# EAGLE schematic ME433 (EAGLE 7.3.0)
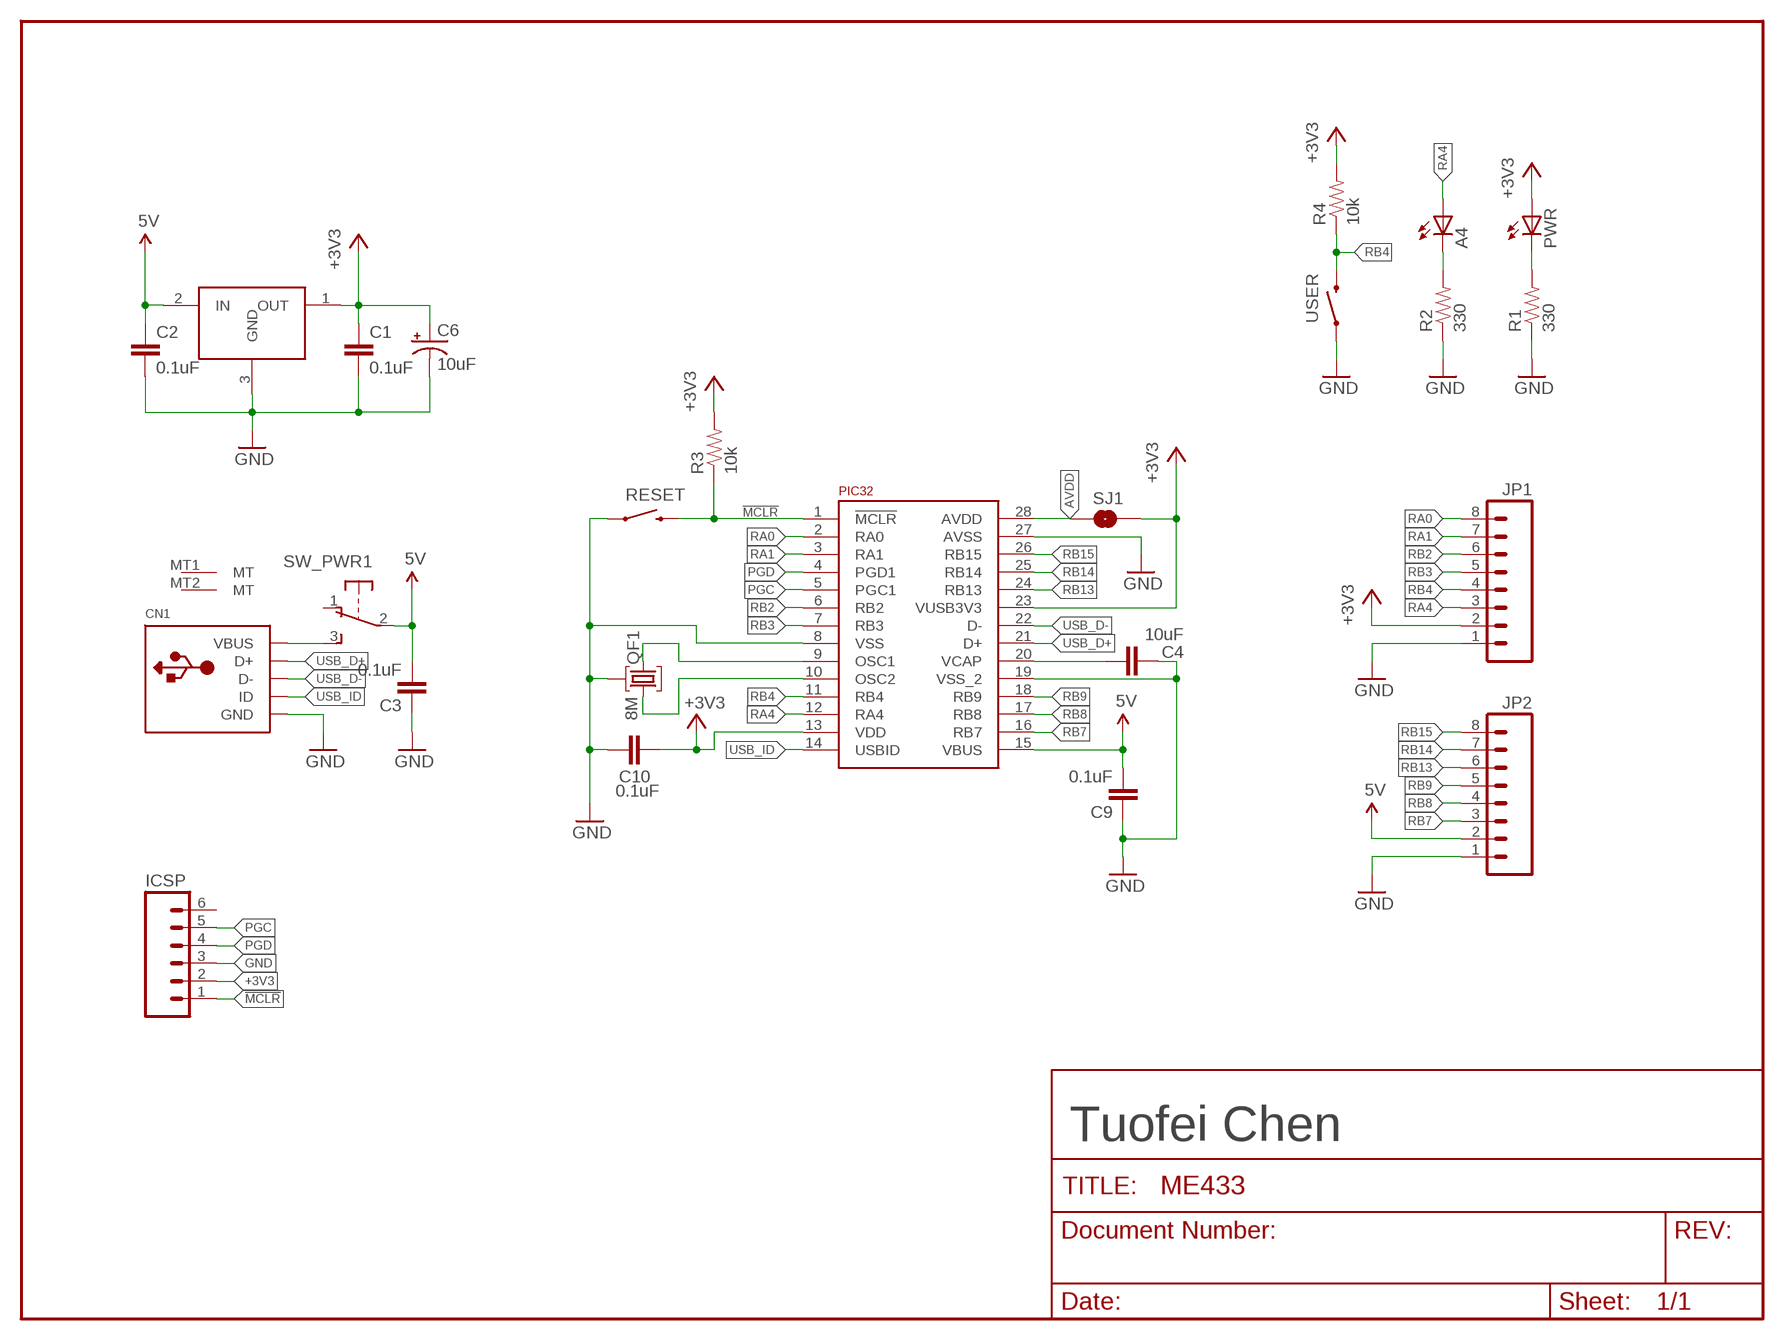
[diagram p0: schematic, sheet 1]

## Parts
3V3-REG  3V3-REG-TO92  [TO-92]
A4  LED3MM  [LED3MM]
C1  0.1uF  CAPPTH  [CAP-PTH-SMALL]
C2  0.1uF  CAPPTH  [CAP-PTH-SMALL]
C3  0.1uF  CAPPTH  [CAP-PTH-SMALL]
C4  10uF  CAPPTH  [CAP-PTH-SMALL]
C6  10uF  CAP_POLPTH1  [CPOL-RADIAL-100UF-25V]
C9  0.1uF  CAPPTH  [CAP-PTH-SMALL]
C10  0.1uF  CAPPTH  [CAP-PTH-SMALL]
CN1  USBMOLEX  [USB-MINIB-THM-MOLEX]
ICSP  M06LONGPADS  [1X06_LONGPADS]
JP1  M08  [1X08]
JP2  M08  [1X08]
PIC32  PIC32MX250F128B-DIP  [DIP28]
PWR  LED3MM  [LED3MM]
QF1  8M  8M10AHC49T  [HC49U]
R1  330  RESISTORAXIAL-0.3  [AXIAL-0.3]
R2  330  RESISTORAXIAL-0.3  [AXIAL-0.3]
R3  10k  RESISTORAXIAL-0.3  [AXIAL-0.3]
R4  10k  RESISTORAXIAL-0.3  [AXIAL-0.3]
RESET  PUSH_BUT  [1X02_LOCK_LONGPADS]
SJ1  SOLDERJUMPERNC  [SJ_2S]
SW_PWR  EG1213  [EG1213]
USER  PUSH_BUT  [1X02_LOCK_LONGPADS]

## Nets
5V: 3V3-REG.2(IN) C2.1 C3.2 C9.2 JP2.2 PIC32.15(VBUS) SW_PWR.2(1:P)
!MCLR: ICSP.1 PIC32.1(!MCLR) R3.P$1 RESET.2
+3V3: 3V3-REG.1(OUT) C1.1 C6.1(+) C10.2 ICSP.2 JP1.2 PIC32.13(VDD) PIC32.23(VUSB3V3) PWR.A R3.P$2 R4.P$2 SJ1.1
AVDD: PIC32.28(AVDD) SJ1.2
GND: 3V3-REG.3(GND) C1.2 C2.2 C3.1 C4.2 C6.2(-) C9.1 C10.1 CN1.GND ICSP.3 JP1.1 JP2.1 PIC32.8(VSS) PIC32.19(VSS_2) PIC32.27(AVSS) QF1.2 R1.P$1 R2.P$1 RESET.1 USER.1
N$1: PIC32.9(OSC1) QF1.1
N$2: PIC32.10(OSC2) QF1.3
N$3: A4.K(C) R2.P$2
N$8: C4.1 PIC32.20(VCAP)
N$12: PWR.K(C) R1.P$2
N$13: CN1.VBUS SW_PWR.3(1:S)
PGC: ICSP.5 PIC32.5(PGC1)
PGD: ICSP.4 PIC32.4(PGD1)
RA0: JP1.8 PIC32.2(RA0)
RA1: JP1.7 PIC32.3(RA1)
RA4: A4.A JP1.3 PIC32.12(RA4)
RB2: JP1.6 PIC32.6(RB2)
RB3: JP1.5 PIC32.7(RB3)
RB4: JP1.4 PIC32.11(RB4) R4.P$1 USER.2
RB7: JP2.3 PIC32.16(RB7)
RB8: JP2.4 PIC32.17(RB8)
RB9: JP2.5 PIC32.18(RB9)
RB13: JP2.6 PIC32.24(RB13)
RB14: JP2.7 PIC32.25(RB14)
RB15: JP2.8 PIC32.26(RB15)
USB_D+: CN1.D+ PIC32.21(D+)
USB_D-: CN1.D- PIC32.22(D-)
USB_ID: CN1.ID PIC32.14(USBID)
Unconnected: ICSP.6 SW_PWR.1(1:O) SW_PWR.MT1(MT) SW_PWR.MT2(MT)

## Notes on the sheet
- Tuofei Chen

## Library data of the parts
3V3-REG = Francis-Project:3V3-REG-TO92
A4 PWR = SparkFun:LED: LEDs Standard schematic elements and footprints for 5mm, 3mm, 1206, and 0603 sized LEDs. 5mm - Spark Fun Electronics SKU : COM-00529 (and others)
C1-C4 C9 C10 = SparkFun-Capacitors:CAP: Capacitor Standard 0603 ceramic capacitor, and 0.1" leaded capacitor.
C6 = SparkFun:CAP_POL: Capacitor Polarized These are standard SMD and PTH capacitors. Normally 10uF, 47uF, and 100uF in electrolytic and tantalum varieties. Always verify the external diameter of the through hole cap, it varies with capacity, voltage, and manufacturer. The EIA devices should be standard.
CN1 = adafruit:USB: USB Connectors USBMINIB - Surface Mount Female Mini-B USB Connector 4UConnector: 06564 By microbuilder.eu Thru-hole RA Female Mini-B USB Connector 4UConnector: 18732 By ladyada.net
ICSP = SparkFun:M06: Header 6 Standard 6-pin 0.1" header. Use with straight break away headers (SKU : PRT-00116), right angle break away headers (PRT-00553), swiss pins (PRT-00743), machine pins (PRT-00117), and female headers (PRT-00115). Molex polarized connector foot print use with SKU : PRT-08094 with associated crimp pins and housings. NOTES ON THE VARIANTS LOCK and LOCK_LONGPADS... This footprint was designed to help hold the alignment of a through-hole component (i.e. 6-pin header) while soldering it into place. You may notice that each hole has been shifted either up or down by 0.005 of an inch from it's more standard position (which is a perfectly straight line). This slight alteration caused the pins (the squares in the middle) to touch the edges of the holes. Because they are alternating, it causes a "brace" to hold the component in place. 0.005 has proven to be the perfect amount of "off-center" position when using our standard breakaway headers. Although looks a little odd when you look at the bare footprint, once you have a header in there, the alteration is very hard to notice. Also, if you push a header all the way into place, it is covered up entirely on the bottom side. This idea of altering the position of holes to aid alignment will be further integrated into the Sparkfun Library for other footprints. It can help hold any component with 3 or more connection pins.
JP1 JP2 = SparkFun:M08: Header 8 Standard 8-pin 0.1" header. Use with straight break away headers (SKU : PRT-00116), right angle break away headers (PRT-00553), swiss pins (PRT-00743), machine pins (PRT-00117), and female headers (PRT-00115).
PIC32 = Francis-Project:PIC32MX250F128B-DIP
QF1 = crystal:8M10AHC49T: Monolithic Crystal Filters Source: www.vanlong.com; OC_FARNELL: unknown; OC_NEWARK: unknown
R1-R4 = SparkFun-Resistors:RESISTOR: Resistor Basic schematic elements and footprints for 0603, 1206, and PTH resistors.
RESET USER = Francis-Project:PUSH_BUT
SJ1 = SparkFun:SOLDERJUMPER: Solder Jumper Standard SMD solder jumper. Used to automate production. Two varients : Normally Open and Normally Closed are the same, but have different paste layers. NC will have a large amount of paste and should jumper during reflow.
SW_PWR = adafruit:EG1213: E-Switch right-angle slide SPDT Part #EG1213 http://www.ladyada.net/library/eagle